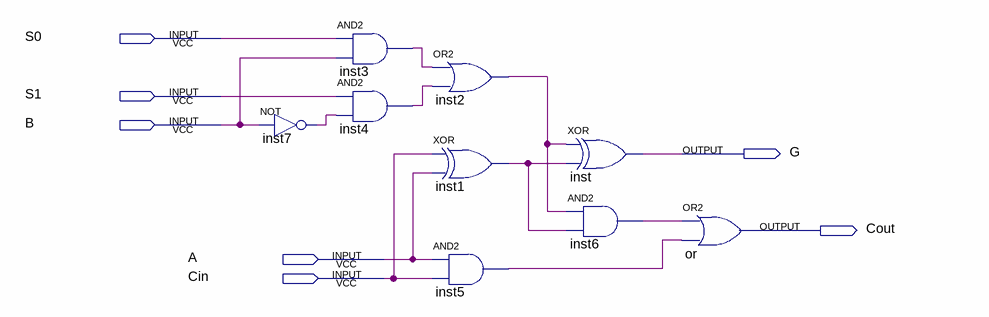
[diagram p0: schematic sheet]
// Quartus schematic Arithm.bdf as structural Verilog: 9 symbols, 7 pins
module Arithm (
  input  S0,
  input  S1,
  input  B,
  input  A,
  input  Cin,
  output G,
  output Cout
);

  wire inst1_out, inst2_out, inst3_out, inst4_out, inst5_out, inst6_out, inst7_out;

  not inst7 (inst7_out, B);
  and inst3 (inst3_out, S0, B);
  and inst4 (inst4_out, S1, inst7_out);
  or inst2 (inst2_out, inst3_out, inst4_out);
  xor inst1 (inst1_out, Cin, A);
  and inst5 (inst5_out, A, Cin);
  xor inst (G, inst2_out, inst1_out);
  and inst6 (inst6_out, inst2_out, inst1_out);
  or \or  (Cout, inst6_out, inst5_out);
endmodule
